# EAGLE schematic RAFT_DuckLink_ReferenceDesigns (EAGLE 9.5.2)

## Sheet 1 of 2
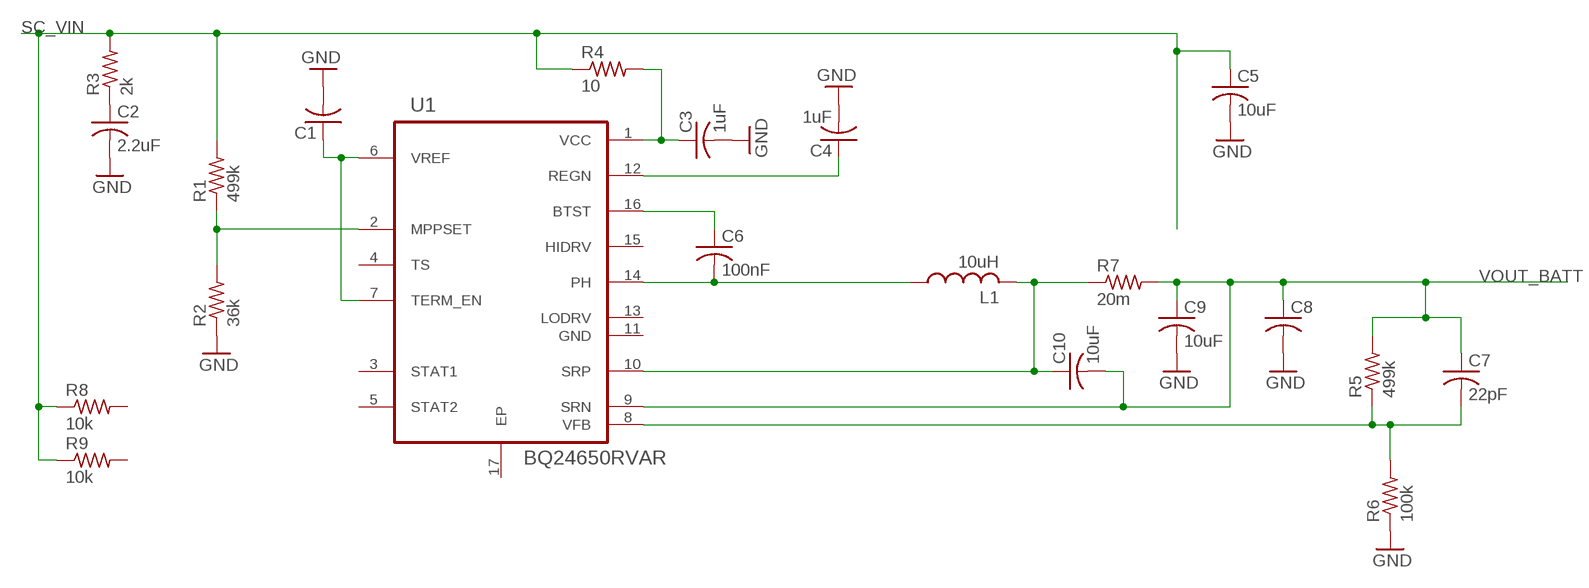
[diagram p0: schematic, sheet 1]

### Parts
C1  C-USC0805  [C0805]
C2  2.2uF  C-USC0805  [C0805]
C3  1uF  C-USC0805  [C0805]
C4  1uF  C-USC0805  [C0805]
C5  10uF  C-USC0805  [C0805]
C6  100nF  C-USC0805  [C0805]
C7  22pF  C-USC0805  [C0805]
C8  C-USC0805  [C0805]
C9  10uF  C-USC0805  [C0805]
C10  10uF  C-USC0805  [C0805]
L1  10uH  L-USL3225M  [L3225M]
R1  499k  R-US_R0805  [R0805]
R2  36k  R-US_R0805  [R0805]
R3  2k  R-US_R0805  [R0805]
R4  10  R-US_R0805  [R0805]
R5  499k  R-US_R0805  [R0805]
R6  100k  R-US_R0805  [R0805]
R7  20m  R-US_R0805  [R0805]
R8  10k  R-US_R0805  [R0805]
R9  10k  R-US_R0805  [R0805]
U1  BQ24650RVAR  [QFN50P350X350X100-17N]

### Nets
GND: C1.2 C2.2 C3.2 C4.2 C5.2 C8.2 C9.2 R2.1 R6.1 ; also sheet 2
N$1: R1.1 R2.2 U1.2(MPPSET)
N$2: C1.1 U1.6(VREF) U1.7(TERM_EN)
N$3: C2.1 R3.1
N$4: C3.1 R4.2 U1.1(VCC)
N$5: C4.1 U1.12(REGN)
N$6: C6.2 L1.1 U1.14(PH)
N$7: C6.1 U1.16(BTST)
N$9: C7.2 R5.1 R6.2 U1.8(VFB)
N$11: C10.1 L1.2 R7.1 U1.10(SRP)
SC_VIN: C5.1 R1.2 R3.2 R4.1 R8.1 R9.1
VOUT_BATT: C7.1 C8.1 C9.1 C10.2 R5.2 R7.2 U1.9(SRN)
Unconnected: R8.2 R9.2 U1.3(STAT1) U1.4(TS) U1.5(STAT2) U1.11(GND) U1.13(LODRV) U1.15(HIDRV) U1.17(EP)

## Sheet 2 of 2
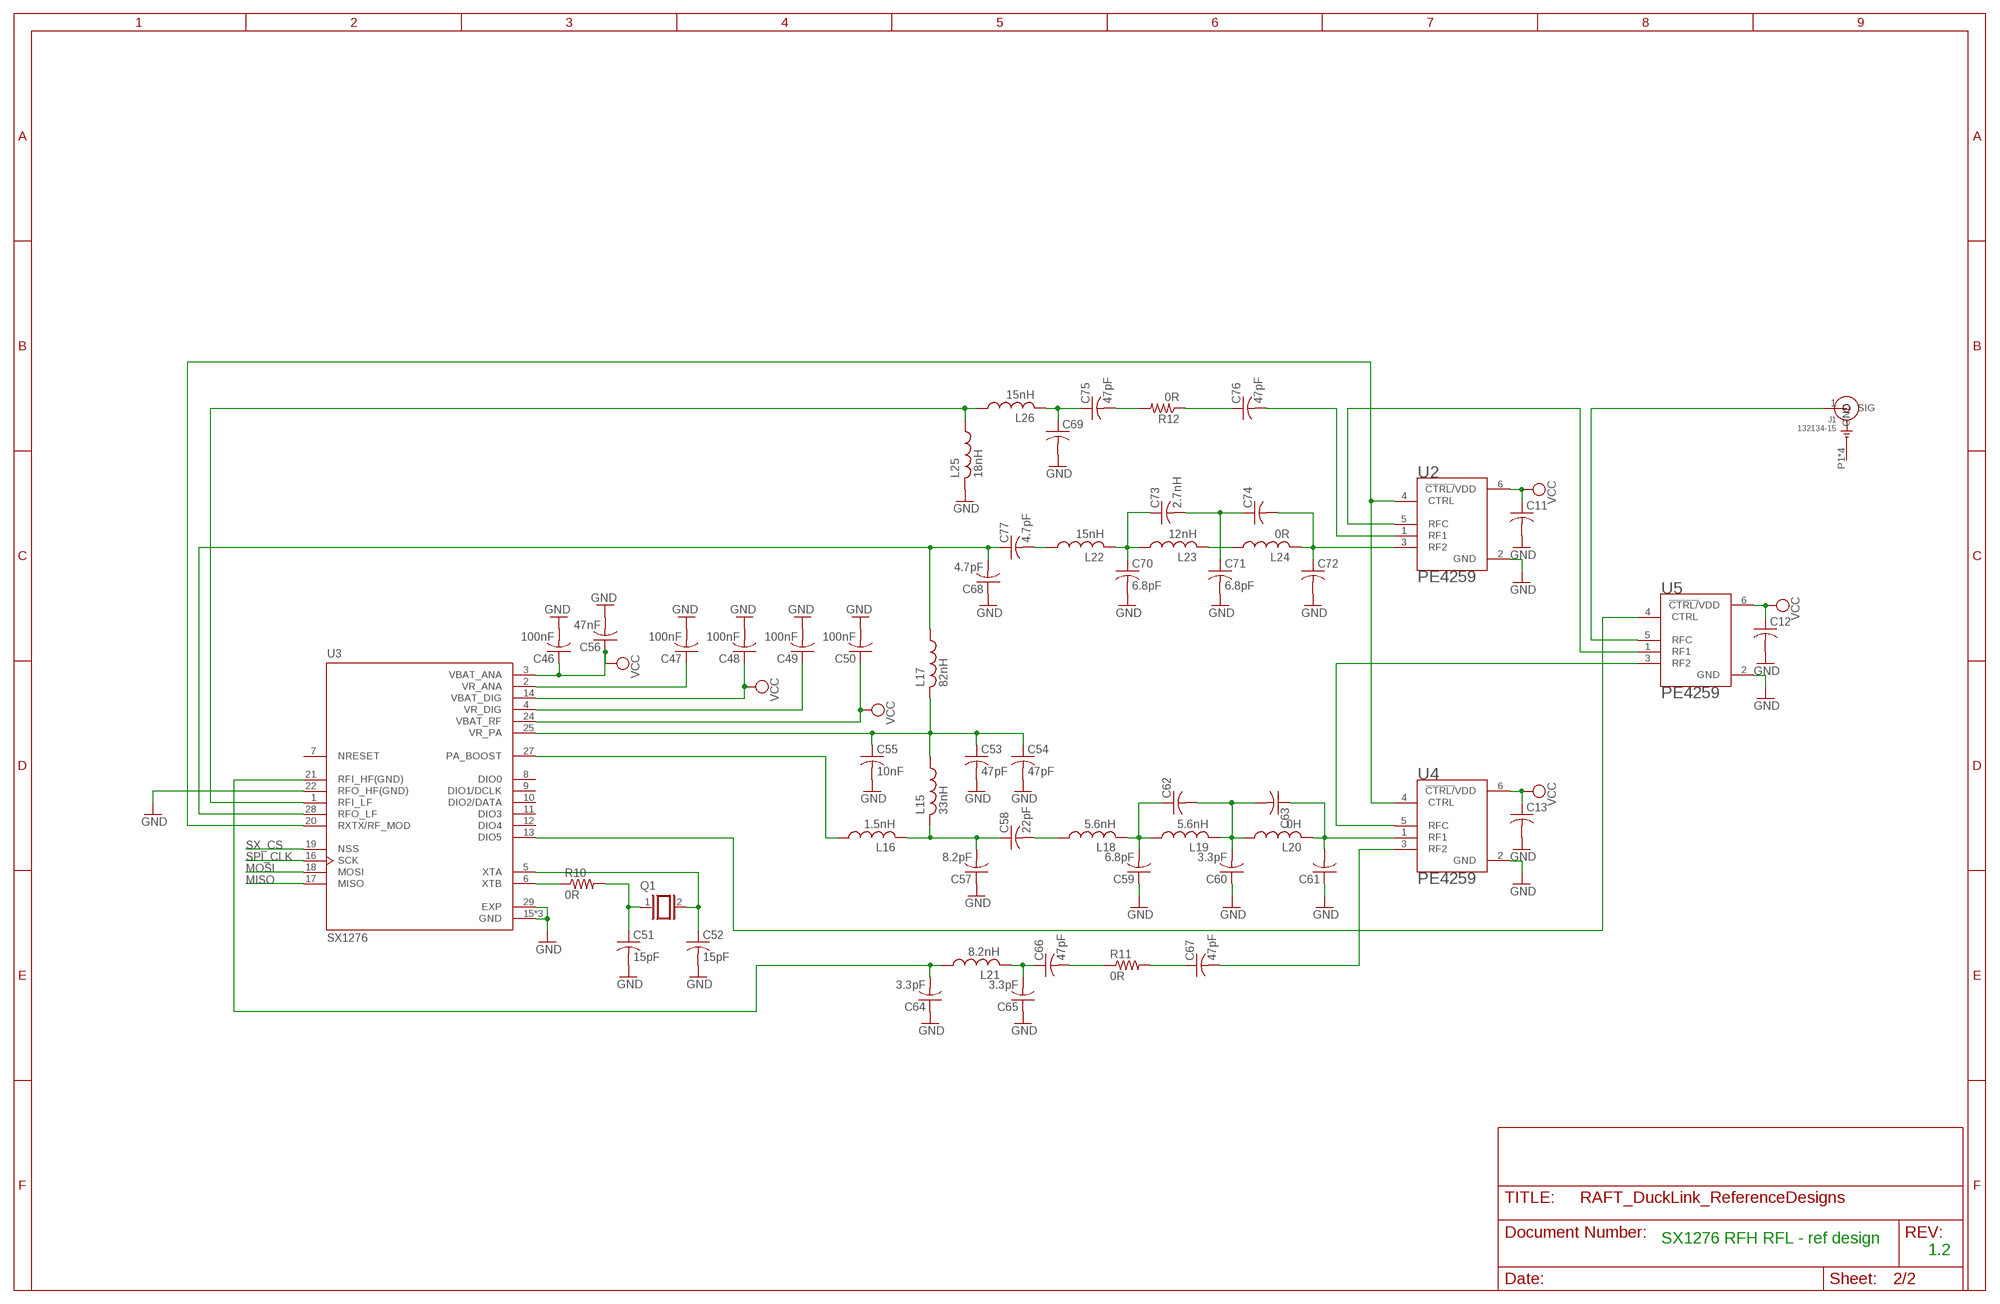
[diagram p1: schematic, sheet 2]

### Parts
C11  C-USC0805  [C0805]
C12  C-USC0805  [C0805]
C13  C-USC0805  [C0805]
C46  100nF  C-USC0805  [C0805]
C47  100nF  C-USC0805  [C0805]
C48  100nF  C-USC0805  [C0805]
C49  100nF  C-USC0805  [C0805]
C50  100nF  C-USC0805  [C0805]
C51  15pF  C-USC0805  [C0805]
C52  15pF  C-USC0805  [C0805]
C53  47pF  C-USC0805  [C0805]
C54  47pF  C-USC0805  [C0805]
C55  10nF  C-USC0805  [C0805]
C56  47nF  C-USC0805  [C0805]
C57  8.2pF  C-USC0805  [C0805]
C58  22pF  C-USC0805  [C0805]
C59  6.8pF  C-USC0805  [C0805]
C60  3.3pF  C-USC0805  [C0805]
C61  C-USC0805  [C0805]
C62  C-USC0805  [C0805]
C63  C-USC0805  [C0805]
C64  3.3pF  C-USC0805  [C0805]
C65  3.3pF  C-USC0805  [C0805]
C66  47pF  C-USC0805  [C0805]
C67  47pF  C-USC0805  [C0805]
C68  4.7pF  C-USC0805  [C0805]
C69  C-USC0805  [C0805]
C70  6.8pF  C-USC0805  [C0805]
C71  6.8pF  C-USC0805  [C0805]
C72  C-USC0805  [C0805]
C73  2.7nH  C-USC0805  [C0805]
C74  C-USC0805  [C0805]
C75  47pF  C-USC0805  [C0805]
C76  47pF  C-USC0805  [C0805]
C77  4.7pF  C-USC0805  [C0805]
J1  132134-15  [AMPHENOL_132134-15]
L15  33nH  L-USL3225M  [L3225M]
L16  1.5nH  L-USL3225M  [L3225M]
L17  82nH  L-USL3225M  [L3225M]
L18  5.6nH  L-USL3225M  [L3225M]
L19  5.6nH  L-USL3225M  [L3225M]
L20  0H  L-USL3225M  [L3225M]
L21  8.2nH  L-USL3225M  [L3225M]
L22  15nH  L-USL3225M  [L3225M]
L23  12nH  L-USL3225M  [L3225M]
L24  0R  L-USL3225M  [L3225M]
L25  18nH  L-USL3225M  [L3225M]
L26  15nH  L-USL3225M  [L3225M]
Q1  XTAL/S  [QS]
R10  0R  R-US_R0805  [R0805]
R11  0R  R-US_R0805  [R0805]
R12  0R  R-US_R0805  [R0805]
U2  PE4259  [SOT65P215X110-6N]
U3  SX1276  [QFN65P600X600X100-29N]
U4  PE4259  [SOT65P215X110-6N]
U5  PE4259  [SOT65P215X110-6N]

### Nets
GND: C11.2 C12.2 C13.2 C46.2 C47.2 C48.2 C49.2 C50.2 C51.2 C52.2 C53.2 C54.2 C55.2 C56.2 C57.1 C59.1 C60.1 C61.1 C64.1 C65.1 C68.1 C69.2 C70.2 C71.2 C72.2 L25.2 U2.2(GND) U3.15(GND) U3.22(RFO_HF(GND)) U3.23(GND) U3.26(GND) U3.29(EXP) U4.2(GND) U5.2(GND) ; also sheet 1
MISO: U3.17(MISO)
MOSI: U3.18(MOSI)
N$8: U2.5(RFC) U5.1(RF1)
N$10: U4.5(RFC) U5.3(RF2)
N$12: J1.1(SIG) U5.5(RFC)
N$13: U3.13(DIO5) U5.4(CTRL)
N$34: R10.1 U3.6(XTB)
N$35: C47.1 U3.2(VR_ANA)
N$36: C51.1 Q1.1 R10.2
N$37: C49.1 U3.4(VR_DIG)
N$38: C52.1 Q1.2 U3.5(XTA)
N$39: C53.1 C54.1 C55.1 L15.1 L17.2 U3.25(VR_PA)
N$40: C68.2 C77.1 L17.1 U3.28(RFO_LF)
N$41: C57.2 C58.1 L15.2 L16.2
N$42: L16.1 U3.27(PA_BOOST)
N$43: C58.2 L18.1
N$44: C59.2 C62.1 L18.2 L19.1
N$45: C60.2 C62.2 C63.2 L19.2 L20.1
N$46: C61.2 C63.1 L20.2 U4.1(RF1)
N$47: C70.1 C73.1 L22.2 L23.1
N$48: C64.2 L21.1 U3.21(RFI_HF(GND))
N$49: C65.2 C66.1 L21.2
N$50: C66.2 R11.1
N$51: C67.1 R11.2
N$52: C67.2 U4.3(RF2)
N$53: C77.2 L22.1
N$54: C71.1 C73.2 C74.1
N$55: L23.2 L24.1
N$56: C72.1 C74.2 L24.2 U2.3(RF2)
N$57: L25.1 L26.1 U3.1(RFI_LF)
N$58: C69.1 C75.1 L26.2
N$59: C75.2 R12.2
N$60: C76.1 R12.1
N$61: C76.2 U2.1(RF1)
N$90: U2.4(CTRL) U3.20(RXTX/RF_MOD) U4.4(CTRL)
SPI_CLK: U3.16(SCK)
SX_CS: U3.19(NSS)
VCC: C11.1 C12.1 C13.1 C46.1 C48.1 C50.1 C56.1 U2.6(!CTRL/!VDD) U3.3(VBAT_ANA) U3.14(VBAT_DIG) U3.24(VBAT_RF) U4.6(!CTRL/!VDD) U5.6(!CTRL/!VDD)
Unconnected: J1.P1(GND) J1.P2(GND) J1.P3(GND) J1.P4(GND) U3.7(NRESET) U3.8(DIO0) U3.9(DIO1/DCLK) U3.10(DIO2/DATA) U3.11(DIO3) U3.12(DIO4)

### Notes on the sheet
- SX1276 RFH RFL - ref design
- 1.2

## Library data of the parts
C1-C13 C46-C77 = rcl:C-US: CAPACITOR, American symbol; SPICEPREFIX: C
J1 = 132134-15:132134-15: Rf Coaxial, Sma, Straight Jack, Pcb; AVAILABILITY: Unavailable; DESCRIPTION: RF Connector SMA Straight PCB Jack Surface Mount 50 Ohm; MF: Amphenol RF; MP: 132134-15; PACKAGE: None; PRICE: None
L1 L15-L26 = rcl:L-US: INDUCTOR, American symbol; SPICEPREFIX: L
Q1 = special:XTAL/S: CRYSTAL
R1-R12 = rcl:R-US_: RESISTOR, American symbol; SPICEPREFIX: R
U1 = TexasInstruments:BQ24650RVAR: Synchronous Switch-Mode Battery Charge Controller; AVAILABILITY: Unavailable; DESCRIPTION: Charger IC Multi-Chemistry 16-VQFN _3.5x3.5_; MF: Texas Instruments; MP: BQ24650RVAR; PACKAGE: VFQFN-16 Murata Power Solutions; PRICE: None
U2 U4 U5 = PE4259:PE4259: SPDT High Power UltraCMOS 10 MHz–3.0 GHz RF Switch; AVAILABILITY: Unavailable; MF: pSemi; MP: PE4259; PACKAGE: SOT-363 Peregrine Semiconductor; PRICE: None
U3 = SX1276:SX1276: RF Transceiver FSK/GFSK/MSK/GMSK/LoRa/OOK 137MHz to 1020MHz 28-Pin QFN; AVAILABILITY: Unavailable; DESCRIPTION: RF Transceiver FSK/GFSK/MSK/GMSK/LoRa/OOK 137MHz to 1020MHz 28-Pin QFN; MF: Semtech Corporation; MP: SX1276; PACKAGE: VQFN-28 Semtech Corporation; PRICE: None